# Altium schematic sheet EASAT_TRANSPODER.SchDoc
size A3
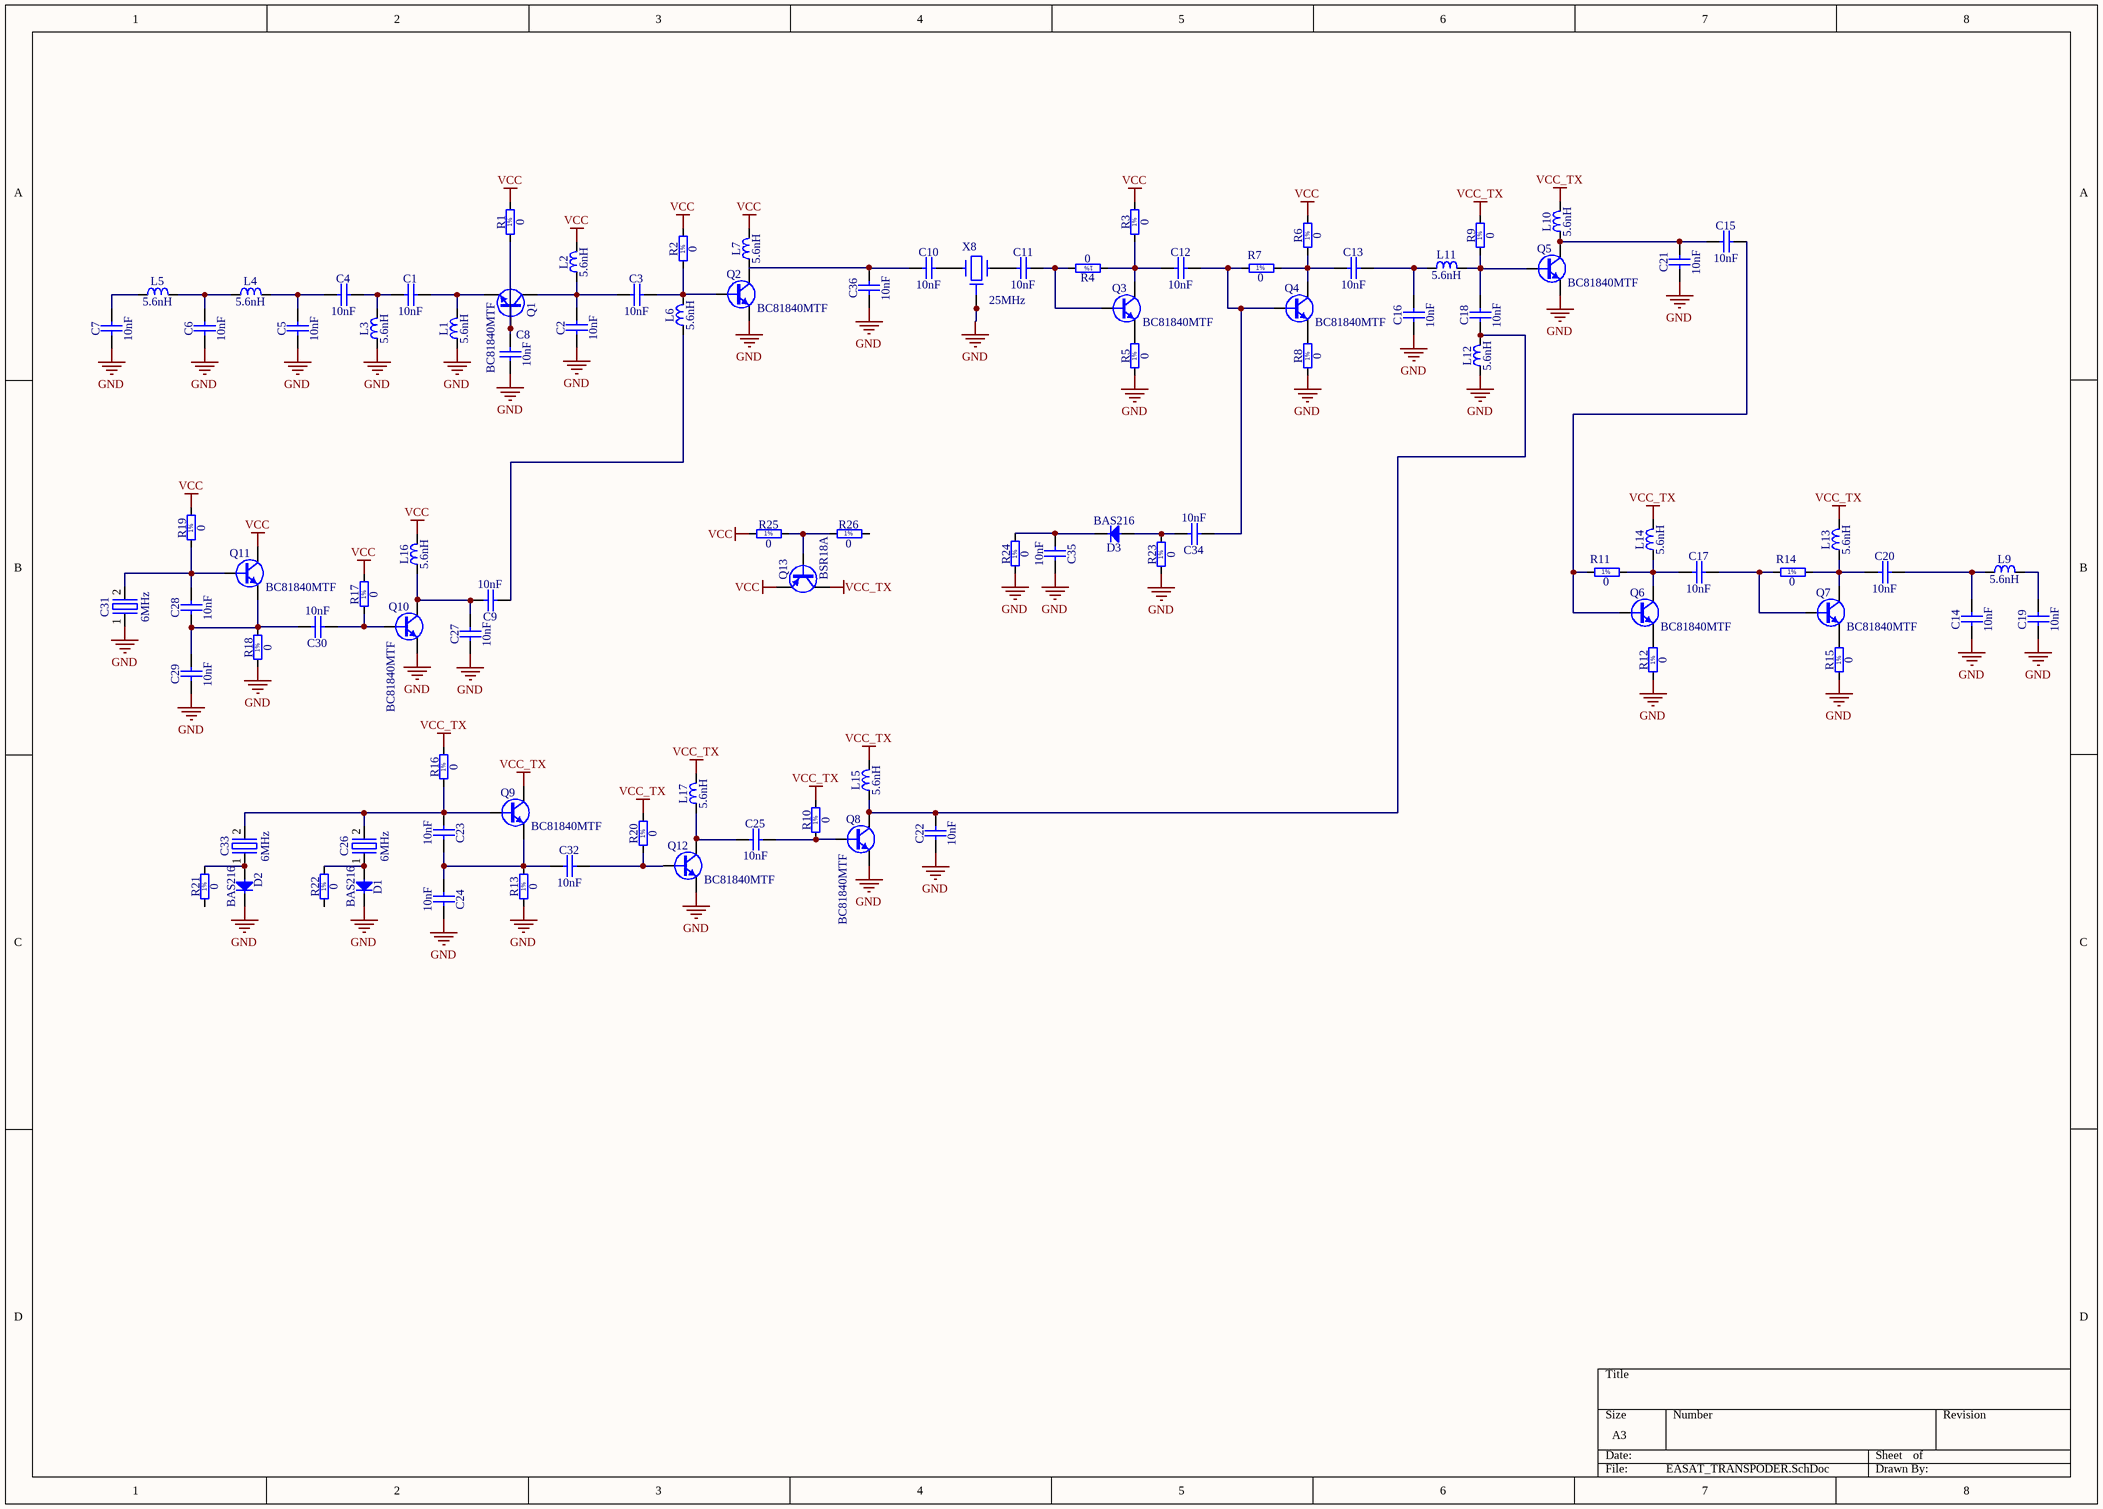
[diagram p0: EASAT_TRANSPODER.SchDoc]

## Parts
C1  10nF  [CAPC1005X55N]
C2  10nF  [CAPC1005X55N]
C3  10nF  [CAPC1005X55N]
C4  10nF  [CAPC1005X55N]
C5  10nF  [CAPC1005X55N]
C6  10nF  [CAPC1005X55N]
C7  10nF  [CAPC1005X55N]
C8  10nF  [CAPC1005X55N]
C9  10nF  [CAPC1005X55N]
C10  10nF  [CAPC1005X55N]
C11  10nF  [CAPC1005X55N]
C12  10nF  [CAPC1005X55N]
C13  10nF  [CAPC1005X55N]
C14  10nF  [CAPC1005X55N]
C15  10nF  [CAPC1005X55N]
C16  10nF  [CAPC1005X55N]
C17  10nF  [CAPC1005X55N]
C18  10nF  [CAPC1005X55N]
C19  10nF  [CAPC1005X55N]
C20  10nF  [CAPC1005X55N]
C21  10nF  [CAPC1005X55N]
C22  10nF  [CAPC1005X55N]
C23  10nF  [CAPC1005X55N]
C24  10nF  [CAPC1005X55N]
C25  10nF  [CAPC1005X55N]
C26  6MHz  [XTAL1160X490X430]
C27  10nF  [CAPC1005X55N]
C28  10nF  [CAPC1005X55N]
C29  10nF  [CAPC1005X55N]
C30  10nF  [CAPC1005X55N]
C31  6MHz  [XTAL1160X490X430]
C32  10nF  [CAPC1005X55N]
C33  6MHz  [XTAL1160X490X430]
C34  10nF  [CAPC1005X55N]
C35  10nF  [CAPC1005X55N]
C36  10nF  [CAPC1005X55N]
D1  BAS216  [DIOM2012X160N]
D2  BAS216  [DIOM2012X160N]
D3  BAS216  [DIOM2012X160N]
L1  5.6nH  [INDM3225X240N]
L2  5.6nH  [INDM3225X240N]
L3  5.6nH  [INDM3225X240N]
L4  5.6nH  [INDM3225X240N]
L5  5.6nH  [INDM3225X240N]
L6  5.6nH  [INDM3225X240N]
L7  5.6nH  [INDM3225X240N]
L9  5.6nH  [INDM3225X240N]
L10  5.6nH  [INDM3225X240N]
L11  5.6nH  [INDM3225X240N]
L12  5.6nH  [INDM3225X240N]
L13  5.6nH  [INDM3225X240N]
L14  5.6nH  [INDM3225X240N]
L15  5.6nH  [INDM3225X240N]
L16  5.6nH  [INDM3225X240N]
L17  5.6nH  [INDM3225X240N]
Q1  BC81840MTF  [SOT95P240X110-3N]
Q2  BC81840MTF  [SOT95P240X110-3N]
Q3  BC81840MTF  [SOT95P240X110-3N]
Q4  BC81840MTF  [SOT95P240X110-3N]
Q5  BC81840MTF  [SOT95P240X110-3N]
Q6  BC81840MTF  [SOT95P240X110-3N]
Q7  BC81840MTF  [SOT95P240X110-3N]
Q8  BC81840MTF  [SOT95P240X110-3N]
Q9  BC81840MTF  [SOT95P240X110-3N]
Q10  BC81840MTF  [SOT95P240X110-3N]
Q11  BC81840MTF  [SOT95P240X110-3N]
Q12  BC81840MTF  [SOT95P240X110-3N]
Q13  BSR18A  [SOT95P240X110-3N]
R1  0  [RESC1005X40N]
R2  0  [RESC1005X40N]
R3  0  [RESC1005X40N]
R4  0  [RESC1005X40N]
R5  0  [RESC1005X40N]
R6  0  [RESC1005X40N]
R7  0  [RESC1005X40N]
R8  0  [RESC1005X40N]
R9  0  [RESC1005X40N]
R10  0  [RESC1005X40N]
R11  0  [RESC1005X40N]
R12  0  [RESC1005X40N]
R13  0  [RESC1005X40N]
R14  0  [RESC1005X40N]
R15  0  [RESC1005X40N]
R16  0  [RESC1005X40N]
R17  0  [RESC1005X40N]
R18  0  [RESC1005X40N]
R19  0  [RESC1005X40N]
R20  0  [RESC1005X40N]
R21  0  [RESC1005X40N]
R22  0  [RESC1005X40N]
R23  0  [RESC1005X40N]
R24  0  [RESC1005X40N]
R25  0  [RESC1005X40N]
R26  0  [RESC1005X40N]
X8  25MHz  [OSC_IQD_CFPS-39]

## Nets
GND: C2.1 C5.1 C6.1 C7.1 C8.1 C14.1 C16.1 C19.1 C21.1 C22.1 C24.2 C27.1 C29.1 C31.1(OSC1) C35.2 C36.1 D1.1(C) D2.1(C) L1.1 L3.1 L12.1 Q2.2(E) Q5.2(E) Q8.2(E) Q10.2(E) Q12.2(E) R5.1 R8.1 R12.1 R13.1 R15.1 R18.1 R23.1 R24.1 X8.2 X8.4
VCC: L2.2 L7.2 L16.2 Q11.3(C) Q13.2(E) R1.2 R2.2 R3.2 R6.2 R17.2 R19.2 R25.1
VCC_TX: L10.2 L13.2 L14.2 L15.2 L17.2 Q9.3(C) Q13.3(C) R9.2 R10.2 R16.2 R20.2
NetC1_1: C1.1 C4.2 L3.2
NetC1_2: C1.2 L1.2 Q1.2(E)
NetC2_2: C2.2 C3.1 L2.1 Q1.3(C)
NetC3_2: C3.2 L6.2 Q2.1(B) R2.1
NetC4_1: C4.1 C5.2 L4.2
NetC6_2: C6.2 L4.1 L5.2
NetC7_2: C7.2 L5.1
NetC8_2: C8.2 Q1.1(B) R1.1
NetC9_1: C9.1 L6.1
NetC9_2: C9.2 C27.2 L16.1 Q10.3(C)
NetC10_1: C10.1 C36.2 L7.1 Q2.3(C)
NetC10_2: C10.2 X8.1
NetC11_1: C11.1 X8.3
NetC11_2: C11.2 Q3.1(B) R4.2
NetC12_1: C12.1 Q3.3(C) R3.1 R4.1
NetC12_2: C12.2 C34.1 Q4.1(B) R7.1
NetC13_1: C13.1 Q4.3(C) R6.1 R7.2
NetC13_2: C13.2 C16.2 L11.1
NetC14_2: C14.2 C20.2 L9.1
NetC15_1: C15.1 C21.2 L10.1 Q5.3(C)
NetC15_2: C15.2 Q6.1(B) R11.1
NetC17_1: C17.1 L14.1 Q6.3(C) R11.2
NetC17_2: C17.2 Q7.1(B) R14.1
NetC18_1: C18.1 C22.2 L12.2 L15.1 Q8.3(C)
NetC18_2: C18.2 L11.2 Q5.1(B) R9.1
NetC19_2: C19.2 L9.2
NetC20_1: C20.1 L13.1 Q7.3(C) R14.2
NetC23_1: C23.1 C26.2(OSC2) C33.2(OSC2) Q9.1(B) R16.1
NetC23_2: C23.2 C24.1 C32.1 Q9.2(E) R13.2
NetC25_1: C25.1 L17.1 Q12.3(C)
NetC25_2: C25.2 Q8.1(B) R10.1
NetC26_1: C26.1(OSC1) D1.2(A) R22.2
NetC28_1: C28.1 C29.2 C30.2 Q11.2(E) R18.2
NetC28_2: C28.2 C31.2(OSC2) Q11.1(B) R19.1
NetC30_1: C30.1 Q10.1(B) R17.1
NetC32_2: C32.2 Q12.1(B) R20.1
NetC33_1: C33.1(OSC1) D2.2(A) R21.2
NetC34_2: C34.2 D3.2(A) R23.2
NetC35_1: C35.1 D3.1(C) R24.2
NetQ3_2: Q3.2(E) R5.2
NetQ4_2: Q4.2(E) R8.2
NetQ6_2: Q6.2(E) R12.2
NetQ7_2: Q7.2(E) R15.2
NetQ13_1: Q13.1(B) R25.2 R26.1

Not connected (* = marked no-connect by the designer): R21 1; R22 1; R26 2

## Notes on the sheet
- (in symbol R0402_0R_JUMPER) 1%

## Library data of the parts
C1-C25 C27-C30 C32 C34-C36 = CC0402_10NF_16V_10%_X7R: Non-polarised capacitor; Part Description: SMD Multilayer Chip Ceramic Capacitor; Manufacturer: GENERIC; Manufacturer1 Part Number: 223878715636; Voltage: 16V; TC: X7R; Tolerance: ±10%; Table: Capacitors SMD; Part Number: CC0402_10NF_16V_10%_X7R; Component Kind: Standard; Component Type: Standard; Pin Count: 2; Value: 10nF; Status: Not Recommended; Manufacturer Part Number: CC0402_10NF_16V_10%_X7R; Case: 0402; Mounted: Yes; Socket: No; SMD: Yes; Manufacturer1 Example: PHYCOMP; Manufacturer1 ComponentHeight: 0.55mm; HelpURL: \\cern.ch\dfs\Applications\Altium\Datasheets\CC0402_X7R_PHYCOMP.pdf; Author: CERN DEM JLC; CreateDate: 03/12/2007; LatestRevisionDate: 03/12/2007
C26 C31 C33 = XTAL_6MHZ_RAKON_HC49/4H SMX_20/50/10/16: Quartz Crystal; Part Description: Tolerance:± 20ppm, Stability:± 50ppm, -10°C to +70°C, 16pF, Surface Mount Quartz Crystal, HC49/4HSMX Serie; Manufacturer: RAKON; Manufacturer Part Number: 6MHz HC49/4H SMX 20/50/10/16; Table: Crystals & Oscillators; Part Number: XTAL_6MHZ_RAKON_HC49/4H SMX_20/50/10/16; Component Kind: Standard; Component Type: Standard; PackageDescription: HC49/4H SMX Case, SMD Cristal, Body 11.6x4.9mm; Value: 6MHz; Pin Count: 2; Mounted: Yes; Socket: No; SMD: Yes; ComponentHeight: 4.3mm; HelpURL: \\cern.ch\dfs\Applications\Altium\Datasheets\XTAL_RAKON_HC49-4HSMX.pdf; Author: CERN DEM JMW; CreateDate: 07/10/2008; LatestRevisionDate: 03/06/2010
D1-D3 = BAS216: Diode; Part Description: High-Speed Switching Diode; Manufacturer: PHILIPS NXP; Voltage: 75V; Power: 400mW; Table: Diodes; Part Number: BAS216; Component Kind: Standard; Component Type: Standard; Device: BAS216; PackageDescription: SOD110 Diode, Molded Body; 2.00mm L X 1.25mm W, IPC Medium Density; Status: Obsolete; Manufacturer Part Number: BAS216; Pin Count: 2; Case: SOD110; Mounted: Yes; Socket: No; SMD: Yes; ComponentHeight: 1.1mm; HelpURL: \\cern.ch\dfs\Applications\Altium\Datasheets\BAS216.pdf; Author: CERN DEM JLC; CreateDate: 17/11/2008; LatestRevisionDate: 17/11/2008
L1-L7 L9-L17 = IND1210_5.6NH_5%_TDK_NLV32T: Inductor; Part Description: SMT Inductors (Coil) For Signal Line(Wound); Manufacturer: TDK; Manufacturer Part Number: NLV32T-056J-PF; Power: 450mA; Resistance: 0.33R; Tolerance: ±5%; Table: Inductors SMD; Part Number: IND1210_5.6NH_5%_TDK_NLV32T; Component Kind: Standard; Component Type: Standard; Pin Count: 2; Value: 5.6nH; Status: None; Case: 1210; Mounted: Yes; Socket: No; SMD: Yes; ComponentHeight: 2.4mm; HelpURL: \\cern.ch\dfs\Applications\Altium\Datasheets\IND1210_TDK_NLV32T.pdf; Author: CERN DEM JLC; CreateDate: 20/04/2010; LatestRevisionDate: 20/04/2010
Q1-Q12 = BC81840MTF: NPN Transistor; Part Description: 25V 800mA NPN Epitaxial Silicon Transistor; Manufacturer: FAIRCHILD SEMICONDUCTOR; Table: Transistors; Part Number: BC81840MTF; Component Kind: Standard; Component Type: Standard; Device: BC81840MTF; PackageDescription: SOT23 3-Leads, Pitch 0.95mm - Body 1.4x3mm, IPC Medium Density; Manufacturer Part Number: BC81840MTF; Pin Count: 3; Case: SOT23-3; Mounted: Yes; Socket: No; SMD: Yes; ComponentHeight: 1.14mm; HelpURL: \\cern.ch\dfs\Applications\Altium\Datasheets\BC81840MTF.pdf; Author: CERN DEM JLC; CreateDate: 15/07/2010; LatestRevisionDate: 15/07/2010
Q13 = BSR18A: PNP Transistor; Part Description: 40V 200mA PNP General-Purpose Amplifier; Manufacturer: FAIRCHILD SEMICONDUCTOR; Table: Transistors; Part Number: BSR18A; Component Kind: Standard; Component Type: Standard; Device: BSR18A; PackageDescription: SOT23 3-Leads, Pitch 0.95mm - Body 1.4x3mm, IPC Medium Density; Manufacturer Part Number: BSR18A; Pin Count: 3; Case: SOT23-3; Mounted: Yes; Socket: No; SMD: Yes; ComponentHeight: 1.3mm; HelpURL: \\cern.ch\dfs\Applications\Altium\Datasheets\BSR18A.pdf; Author: CERN DEM JLC; CreateDate: 15/05/2008; LatestRevisionDate: 15/05/2008
R1-R26 = R0402_0R_JUMPER: Resistor - 1%; Part Description: 1A (0.05R Max DC Resistance) Zero Ohm Jumper; Manufacturer: GENERIC; Manufacturer1 Part Number: 232270591001; Table: Resistors SMD; Part Number: R0402_0R_JUMPER; Component Kind: Standard; Component Type: Standard; Pin Count: 2; Value: 0; Status: Not recommended; Manufacturer Part Number: R0402_0R_JUMPER; Case: 0402; Mounted: Yes; Socket: No; SMD: Yes; Manufacturer1 Example: PHYCOMP; Manufacturer1 ComponentHeight: 0.4mm; HelpURL: \\cern.ch\dfs\Applications\Altium\Datasheets\R0402_Phycomp_RC0402.pdf; Author: CERN DEM JLC; CreateDate: 03/12/2007; LatestRevisionDate: 13/03/2008
X8 = XTAL_7M-25.000MAAJ-T: SMD Crystal 7M Series 25 MHz 18pF 30 ppm; Manufacturer: TXC; Table: Crystals & Oscillators; Part Number: XTAL_7M-25.000MAAJ-T; Component Kind: Standard; Component Type: Standard; PackageDescription: SMD Crystal 7M Series 25 MHz 18pF 30 ppm; Value: 25MHz; Part Description: SMD Crystal 7M Series 25 MHz 18pF 30 ppm; Manufacturer Part Number: 7M-25.000MAAJ-T; Pin Count: 4; Mounted: Yes; Socket: No; SMD: Yes; ComponentHeight: 1.05mm; Author: 7S; CreateDate: 21/01/2009; LatestRevisionDate: 21/01/2009